# Altium schematic sheet Motor.SchDoc
size A4
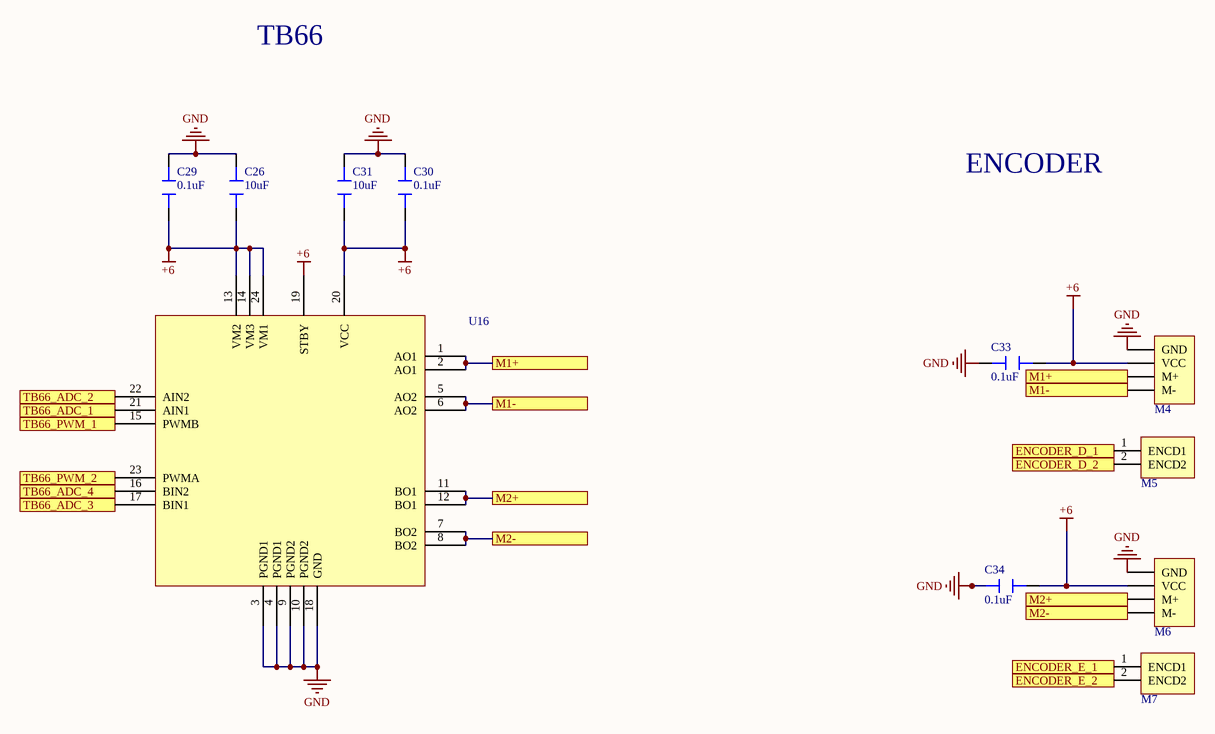
[diagram p0: Motor.SchDoc]

## Parts
C26  10uF  [CAPACITOR 0603]
C29  0.1uF  [CAPACITOR 0805]
C30  0.1uF  [CAPACITOR 0805]
C31  10uF  [CAPACITOR 0603]
C33  0.1uF  [CAPACITOR 0805]
C34  0.1uF  [CAPACITOR 0805]
M4  Headers (1x4)  [HDR1X4]  (value not drawn)
M5  Headers (1x2)ENC  [HDR1X2]  (value not drawn)
M6  Headers (1x4)  [HDR1X4]  (value not drawn)
M7  Headers (1x2)ENC  [HDR1X2]  (value not drawn)
U16  Driver TB6612FNG  [SOP65P760X160-24N]  (value not drawn)

## Ports
ENCODER_D_1, ENCODER_D_2, ENCODER_E_1, ENCODER_E_2, M1+, M1-, M2+, M2-, TB66_ADC_1, TB66_ADC_2, TB66_ADC_3, TB66_ADC_4, TB66_PWM_1, TB66_PWM_2

## Nets
+6: C26.1 C29.1 C30.1 C31.1 C33.1 C34.2 M4.2(VCC) M6.2(VCC) U16.13(VM2) U16.14(VM3) U16.19(STBY) U16.20(VCC) U16.24(VM1)
GND: C26.2 C29.2 C30.2 C31.2 C33.2 C34.1 M4.1(GND) M6.1(GND) U16.3(PGND1) U16.4(PGND1) U16.9(PGND2) U16.10(PGND2) U16.18(GND)
ENCODER_D_1: M5.1(ENCD1) ; port ENCODER_D_1
ENCODER_D_2: M5.2(ENCD2) ; port ENCODER_D_2
ENCODER_E_1: M7.1(ENCD1) ; port ENCODER_E_1
ENCODER_E_2: M7.2(ENCD2) ; port ENCODER_E_2
M1+: M4.3(M+) U16.1(AO1) U16.2(AO1) ; port M1+
M1-: M4.4(M-) U16.5(AO2) U16.6(AO2) ; port M1-
M2+: M6.3(M+) U16.11(BO1) U16.12(BO1) ; port M2+
M2-: M6.4(M-) U16.7(BO2) U16.8(BO2) ; port M2-
TB66_ADC_1: U16.21(AIN1) ; port TB66_ADC_1
TB66_ADC_2: U16.22(AIN2) ; port TB66_ADC_2
TB66_ADC_3: U16.17(BIN1) ; port TB66_ADC_3
TB66_ADC_4: U16.16(BIN2) ; port TB66_ADC_4
TB66_PWM_1: U16.15(PWMB) ; port TB66_PWM_1
TB66_PWM_2: U16.23(PWMA) ; port TB66_PWM_2

## Notes on the sheet
- TB66
- ENCODER

## Library data of the parts
C26 C31 = Capacitor 10uF 0603: Capacitores de cerâmica multicamada MLCC - SMD/SMT 0603 16Vdc 10uF X6S 20%; Manufacturer: Murata; Manufacturer Part Number: GRT188C81C106ME13D; Voltage Rating: 16V; Voltage Rating (DC): 35V; Dielectric: X5R; Supplier 1: Mouser; Stock 1: 1580; Pricing 1: 10000=0.127 (USD); Mount: Surface Mount; Case/Package: 0603; Case Code (Metric): 1608; Case Code (Imperial): 0603; Min Operating Temperature: -55°C; Max Operating Temperature: 105°C; Packaging: Tape and Reel; Capacitance: 10uF; Tolerance: 20%; Length: 0.063inch; Width: 0.031inch; Thickness: 0.035inch; Ratings: AEC-Q200; ComponentLink1Description: Link Mouser; ComponentLink1URL: https://br.mouser.com/ProductDetail/Murata-Electronics/GRT188C81C106ME13D?qs=drgMNd%252bkGPNZ2BDWwi8nsA%3D%3D; Supplier 2: Mouser; Stock 2: 205123; Pricing 2: 1=0.45, 10=0.315, 100=0.188, 500=0.141, 1000=0.119, 4000=0.093, 8000=0.087, 12000=0.084, 24000=0.076 (USD); ComponentLink2URL: http://search.murata.co.jp/Ceramy/image/img/A01X/G101/ENG/GRM188R6YA106MA73-01.pdf?src-supplier=Digi-Key; ComponentLink2Description: http://search.murata.co.jp/Ceramy/image/img/A01X/G101/ENG/GRM188R6YA106MA73-01.pdf?src-supplier=Digi-Key; ComponentLink3URL: http://search.murata.co.jp/Ceramy/image/img/A01X/G101/ENG/GRM188R6YA106MA73-01.pdf?src-supplier=Mouser; ComponentLink3Description: http://search.murata.co.jp/Ceramy/image/img/A01X/G101/ENG/GRM188R6YA106MA73-01.pdf?src-supplier=Mouser; ComponentLink4URL: https://www.murata.com/~/media/webrenewal/support/library/catalog/products/capacitor/mlcc/c02e.ashx?la=en-us&src-supplier=Digi-Key; ComponentLink4Description: https://www.murata.com/~/media/webrenewal/support/library/catalog/products/capacitor/mlcc/c02e.ashx?la=en-us&src-supplier=Digi-Key; ComponentLink5URL: http://search.murata.co.jp/Ceramy/image/img/A01X/G101/ENG/GRM188R6YA106MA73-01.pdf?src-supplier=Future+Electronics; ComponentLink5Description: http://search.murata.co.jp/Ceramy/image/img/A01X/G101/ENG/GRM188R6YA106MA73-01.pdf?src-supplier=Future+Electronics; ComponentLink6URL: http://search.murata.co.jp/Ceramy/image/img/A01X/G101/ENG/GRM188R6YA106MA73-01.pdf?src-supplier=TTI; ComponentLink6Description: http://search.murata.co.jp/Ceramy/image/img/A01X/G101/ENG/GRM188R6YA106MA73-01.pdf?src-supplier=TTI; Category: Multilayer Ceramic Capacitors MLCC - SMD/SMT; Supplier Part Number 2: 81-GRM188R6YA106MA3D
C29 C30 C33 C34 = Capacitor  0.1uF 0805: Multilayer Ceramic Capacitors MLCC - SMD/SMT .1uF 50volts 10%; Manufacturer: Vishay Vitramon; Manufacturer Part Number: VJ0805Y104KXAAT; Capacitance: 100nF; Voltage Rating: 50V; Dielectric: X7R; Supplier 1: Mouser; Stock 1: 207342; Pricing 1: 1=0.2, 10=0.2, 50=0.162, 100=0.108, 500=0.095, 1000=0.084, 3000=0.072, 6000=0.069, 9000=0.065, 10000=0.065 (USD); Mount: Surface Mount; Case/Package: 0805; Weight: 0.000194oz; Case Code (Metric): 2012; Case Code (Imperial): 0805; Min Operating Temperature: -55°C; Max Operating Temperature: 125°C; Tolerance: 10%; Package Quantity: 1; Packaging: Tape and Reel; Voltage Rating (DC): 50V; Termination: SMD/SMT; Voltage: 50V; Length: 2mm; Height: 1.45mm; Width: 0.049inch; Thickness: 0.057inch; Depth: 1.25mm; Radiation Hardening: No; REACH SVHC: Unknown; Lead Free: Lead Free; ComponentLink1URL: http://www.mouser.com/ds/2/427/vjcommercialseries-222796.pdf?src-supplier=Mouser; ComponentLink1Description: http://www.mouser.com/ds/2/427/vjcommercialseries-222796.pdf?src-supplier=Mouser; ComponentLink2URL: http://www.vishay.com/docs/45199/vjcommercialseries.pdf?src-supplier=Digi-Key; ComponentLink2Description: http://www.vishay.com/docs/45199/vjcommercialseries.pdf?src-supplier=Digi-Key; ComponentLink3URL: http://www.vishay.com/docs/45199/vjcommercialseries.pdf?src-supplier=Future+Electronics; ComponentLink3Description: http://www.vishay.com/docs/45199/vjcommercialseries.pdf?src-supplier=Future+Electronics; Supplier Part Number 1: 77-VJ0805Y104KXAAT; Category: Multilayer Ceramic Capacitors MLCC - SMD/SMT
M4 M6 = Headers (1x4): Header, 4-Pin; LatestRevisionDate: 17-Jul-2002; LatestRevisionNote: Re-released for DXP Platform.; Publisher: Altium Limited
M5 M7 = Headers (1x2)ENC: Headers & Wire Housings HDR STRT SINGLE 2P; Manufacturer: Molex; Manufacturer Part Number: 90136-1202; Number of Poles: 2; Current Rating: 3A; Voltage Rating (AC): 350V; Contact Resistance: 20mR; Max Voltage Rating (DC): 350.35kV; Insulation Resistance: 5GR; Gender: Male; Pitch: 2.54mm; Glow Wire Compliant: Non-compliant; Supplier 1: Mouser; Stock 1: 2623; Pricing 1: 1=1.07, 10=0.89, 50=0.89, 100=0.776, 500=0.677, 1000=0.613, 2500=0.536, 10000=0.492, 25000=0.479, 50000=0.467 (USD); Mount: Through Hole; Contact Plating: Gold; Contact Material: Brass,Copper Alloy; Color: Black; Housing Color: Black; Housing Material: Polyester; Min Operating Temperature: -55°C; Max Operating Temperature: 125°C; Number of Rows: 1; Packaging: Tray; Package Quantity: 3040; Voltage Rating: 350V; Number of Positions: 2; Termination: Through Hole; Number of Circuits: 2; Number of Contacts: 2; Working Voltage: 350V; Orientation: Vertical; Voltage Rating (DC): 350V; Lead Pitch: 2.54mm; Radiation Hardening: No; REACH SVHC: Unknown; Lead Free: Lead Free; Flammability Rating: UL94 V-0; ComponentLink1URL: http://www.molex.com/webdocs/datasheets/pdf/en-us/0901361202_PCB_HEADERS.pdf?src-supplier=Avnet+Europe; ComponentLink1Description: http://www.molex.com/webdocs/datasheets/pdf/en-us/0901361202_PCB_HEADERS.pdf?src-supplier=Avnet+Europe; ComponentLink2URL: http://www.mouser.com/ds/2/276/0901361202_PCB_HEADERS-176812.pdf?src-supplier=Mouser; ComponentLink2Description: http://www.mouser.com/ds/2/276/0901361202_PCB_HEADERS-176812.pdf?src-supplier=Mouser; ComponentLink3URL: http://www.molex.com/webdocs/datasheets/pdf/en-us/0901361202_PCB_HEADERS.pdf?src-supplier=Avnet; ComponentLink3Description: http://www.molex.com/webdocs/datasheets/pdf/en-us/0901361202_PCB_HEADERS.pdf?src-supplier=Avnet; ComponentLink4URL: https://www.distrelec.biz/Web/Downloads/_d/wg/cgrid_III_90136_eng_dwg.pdf?mime=application%2Fpdf&src-supplier=Distrelec; ComponentLink4Description: https://www.distrelec.biz/Web/Downloads/_d/wg/cgrid_III_90136_eng_dwg.pdf?mime=application%2Fpdf&src-supplier=Distrelec; ComponentLink5URL: http://uk.rs-online.com/webdocs/1362/0900766b81362c51.pdf?src-supplier=RSComponents; ComponentLink5Description: http://uk.rs-online.com/webdocs/1362/0900766b81362c51.pdf?src-supplier=RSComponents; ComponentLink6URL: http://www.onlinecomponents.com/productFiles/mf-MOL/248400901361202_pcb_headers.pdf?src-supplier=Onlinecomponents.com; ComponentLink6Description: http://www.onlinecomponents.com/productFiles/mf-MOL/248400901361202_pcb_headers.pdf?src-supplier=Onlinecomponents.com; Supplier Part Number 1: 538-90136-1202; Category: Headers & Wire Housings
U16 = Driver TB6612FNG: DC Motor Driver 3V 24-Pin SSOP T/R; Manufacturer: Toshiba; Manufacturer Part Number: TB6612FNG,C,8,EL; Number of Outputs: 2; Min Supply Voltage: 2.7V; Max Supply Voltage: 5.5V; Output Current: 1A; Logic Function: AND; Interface: Parallel; Supplier 1: Mouser; Stock 1: 0; Pricing 1: 1=1.58, 10=1.53, 50=1.53, 100=1.22, 500=1.09, 1000=0.985, 2000=0.91, 10000=0.825 (USD); Mount: Surface Mount; Case/Package: SSOP; Number of Pins: 24; Min Operating Temperature: -20°C; Max Operating Temperature: 85°C; Packaging: Tape and Reel; Package Quantity: 1; Operating Supply Voltage: 3V; ComponentLink1URL: http://www.mouser.com/ds/2/408/TB6612FNG_datasheet_en_20141001-736972.pdf?src-supplier=Mouser; ComponentLink1Description: http://www.mouser.com/ds/2/408/TB6612FNG_datasheet_en_20141001-736972.pdf?src-supplier=Mouser; Supplier Part Number 1: 757-TB6612FNGC8EL; Category: Motor / Motion / Ignition Controllers & Drivers